# EAGLE design touch (EAGLE 5.10)
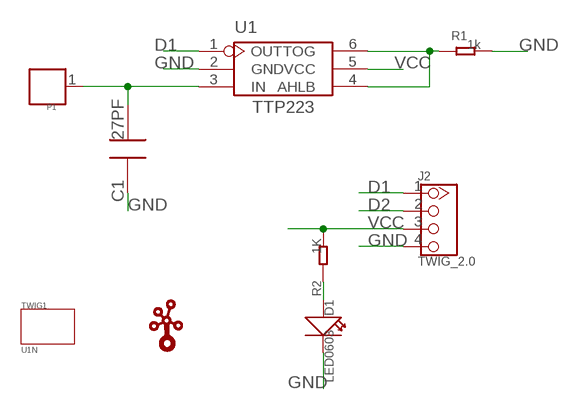
[diagram p0: schematic, sheet 1]

## Parts
C1  27PF  C0603  [0603]
D1  LED0603  [LED0603]
J2  TWIG_2.0  [2.0_1X4]
P1  PAD'D450MIL'  [1P-D450]
R1  1k  R0603  [0603]
R2  1K  R0603  [0603]
TWIG1  U1N  [U1N]
U1  TTP223  [SOT23-6L]
U$1  TWIGLOGOTWIGLOGO_SMALL  [TWIGLOGO_SMALL]

## Nets
D1: J2.1 U1.1(OUT)
D2: J2.2
GND: C1.1 D1.2(-) J2.4 R1.2 U1.2(GND)
IN: C1.2 P1.1 U1.3(IN)
N$2: R1.1 U1.4(AHLB) U1.6(TOG)
N$3: D1.1(+) R2.1
VCC: J2.3 R2.2 U1.5(VCC)

## Notes on the sheet
- TTP223

## Library data of the parts
C1 = CPT_SMD:C0603; C0603: 100N
D1 = CPT_SMD:LED0603
J2 = CONNECTER:TWIG_2.0
P1 = Discrete:PAD
R1 R2 = CPT_SMD:R0603
TWIG1 = twig_template1:U1N
U1 = Seeed:TTP223
U$1 = seeedleo:TWIGLOGO

## Board
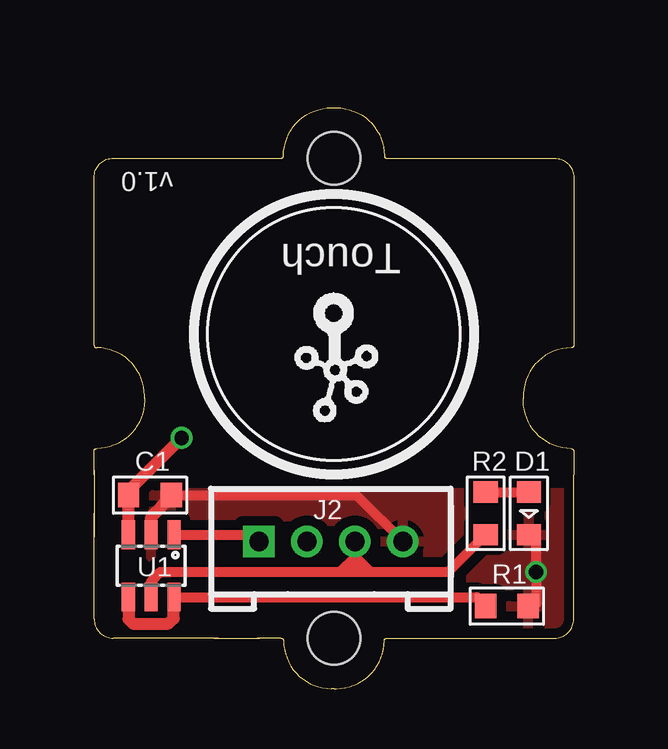
[diagram p1: board, top side]
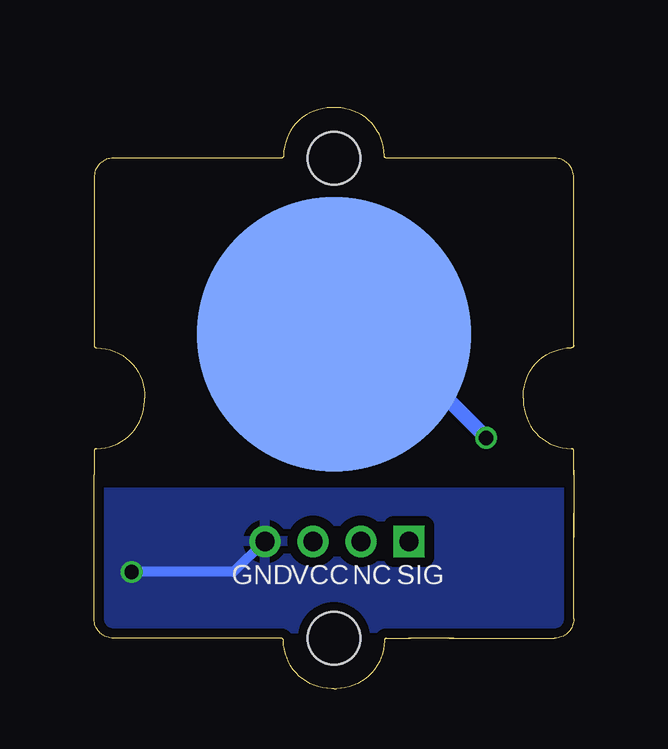
[diagram p2: board, bottom side, seen from below]

Size 20 x 24.2 mm. Coordinates in mm from the lower left corner, seen from the top.
Copper layers (1*16): Top 0.035mm / dielectric 1.5mm / Bottom 0.035mm
Design rules "SeeedStudio_rule_no_angle_090911": minimum track width 6mil, minimum drill 12mil, track to track 6mil, track to pad 6mil, pad to pad 6mil, via to via 6mil, smd to smd 0mil, copper to edge 10mil, drill to drill 10mil, minimum pad ring 10mil, minimum via ring 6mil, stop-mask expansion 2mil, vias tented up to drill 100mil, thermal gap 10mil

### Footprints (pad centres in the part's own frame; a part is rotated, then mirrored left to right if it is on the bottom)
0603 = smd 0.889 x 1.016: 1 -0.889,0; 2 0.889,0
LED0603 = smd 0.889 x 1.016: 1 -0.889,0; 2 0.889,0
2.0_1X4 = drill 0.8 pad 1.27 square: 1 -3,0 | drill 0.8 pad 1.27 round: 2 -1,0; 3 1,0; 4 3,0
1P-D450 = smd 11.43 x 11.43: 1 0,0
U1N = hole 2.2: 0,-10; 0,10
SOT23-6L = smd 0.55 x 1.2: 1 -0.95,-1.3; 2 0,-1.3; 3 0.95,-1.3; 4 0.95,1.3; 5 0,1.3; 6 -0.95,1.3

### Placement (x,y rotation side)
C1  2.33,8.06 180 top
D1  18.13,7.3 270 top
J2  9.87,6.13 0 top
P1  10,14.77 0 bottom
R1  17.21,3.44 0 top
R2  16.32,7.3 270 top
TWIG1  10,12.1 0 top
U1  2.38,5.11 180 top
U$1  12.24,16.62 180 top

### Tracks (layer width: path | path; a pad name or v marks a point on that pad's centre or on a via)
D1
  Top 0.406: U1.1 6.46,6.41 J2.1
GND  (via drill 0.6)
  Top 0.406: 3.37,7.91 C1.1 10.94,8.06 J2.4 | 18.13,3.21 R1.2 18.43,3.51 v18.43,4.86 18.43,6.11 D1.2
  Top 0.508: C1.1 3.22,7.98 2.38,7.15 U1.2
  Bottom 0.406: J2.4 12.92,6.13 14.19,4.86 v18.43,4.86
  pour Bottom (isolate 0.406): -1.43,8.16 21.3,8.16 21.3,-0.98 -1.43,-0.98
  pour Top (isolate 0.406): -1.43,8.16 21.3,8.16 21.3,-1.11 -1.43,-1.11
IN  (via drill 0.6)
  Top 0.508: v3.65,10.45 1.44,8.24 C1.2 1.43,8.05 U1.3
  Bottom 0.61: v3.65,10.45 7.97,14.77 P1.1
N$2
  Top 0.406: U1.6 15.95,3.81 R1.1
  Top 0.508: U1.4 1.43,2.89 1.62,2.7 3.09,2.7 3.32,2.93 U1.6
N$3
  Top 0.406: R2.1 D1.1
VCC
  Top 0.406: U1.5 2.38,4.48 2.76,4.86 10.25,4.86 | 10.25,4.86 10.89,4.86 | 10.89,4.86 11.52,4.86 | J2.3 10.87,4.88 10.89,4.86 | 10.25,4.86 10.89,5.5 11.52,4.86 | 11.52,4.86 14.77,4.86 R2.2

### Text on the board
tPlace: v1.0 | Touch
bPlace: SIG | NC | VCC | GND